# Altium schematic sheet MJE13001_SWITCHING_WITH_FEEDBACK.SchDoc
size A4; SheetNumber: 1; SheetTotal: 1
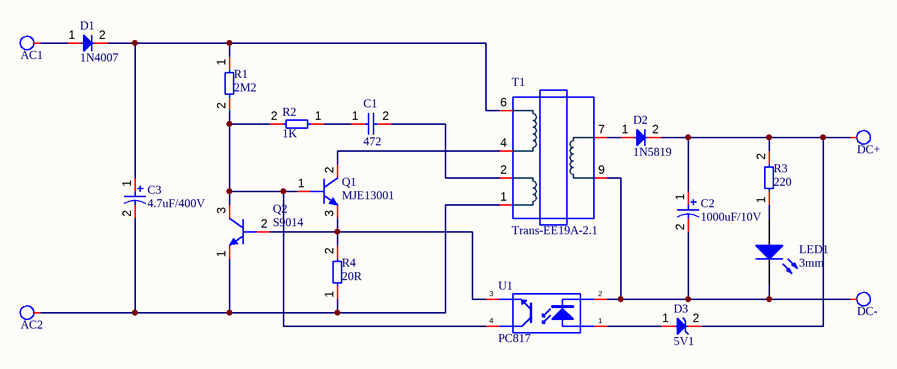
[diagram p0: MJE13001_SWITCHING_WITH_FEEDBACK.SchDoc]

## Parts
AC1  SolderPoint  [SolderPoint]  (value not drawn)
AC2  SolderPoint  [SolderPoint]  (value not drawn)
C1  472  [CAP_DISC_PITCH_2.54MM]
C2  1000uF/10V  [CAP_RAD_7mm]
C3  4.7uF/400V  [CAP_RAD_7mm]
D1  1N4007  [DO-41]
D2  1N5819  [DO-41]
D3  5V1  [DO-35 Horizontal]
DC+  SolderPoint  [SolderPoint]  (value not drawn)
DC-  SolderPoint  [SolderPoint]  (value not drawn)
LED1  3mm  [LED 3mm Green]
Q1  MJE13001  [TO-92]
Q2  S9014  [TO-92]
R1  2M2  [RES-0.25W-H-MF]
R2  1K  [RES-0.25W-H-MF]
R3  220  [R0805]
R4  20R  [RES-0.25W-H-MF]
T1  Trans-EE19A-2.1  [TRANS_EE19A-2.1]
U1  PC817  [DIP4]

## Nets
NetAC1_1: AC1.1 D1.1
NetAC2_1: AC2.1 C3.2 Q2.1(E) R4.1 T1.1
NetC1_1: C1.1 R2.1
NetC1_2: C1.2 T1.2
NetC2_1: C2.1 D2.2 D3.2 DC+.1 R3.2
NetC2_2: C2.2 DC-.1 LED1.2(K) T1.9 U1.2(K)
NetC3_1: C3.1 D1.2 R1.1 T1.6
NetD2_1: D2.1 T1.7
NetD3_1: D3.1 U1.1(A)
NetLED1_1: LED1.1(A) R3.1
NetQ1_1: Q1.1(B) Q2.3(C) R1.2 R2.2 U1.4(C)
NetQ1_2: Q1.2(C) T1.4
NetQ1_3: Q1.3(E) Q2.2(B) R4.2 U1.3(E)

## Library data of the parts
C1 = Capacitors(Disc)
C2 C3 = Capacitor(Radian)
D2 = 1N4007
D3 = Diode Zener
LED1 = LED 3mm
Q1 = MJE13001_Type_F
R1 R2 R4 = Resistors THD
R3 = Resistor SMD